# EAGLE schematic gator (EAGLE 6.3)
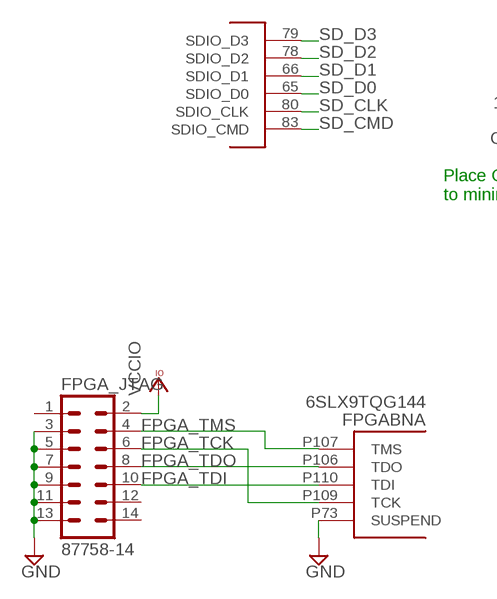
[diagram p0: schematic, sheet 1, part 1 of 2]
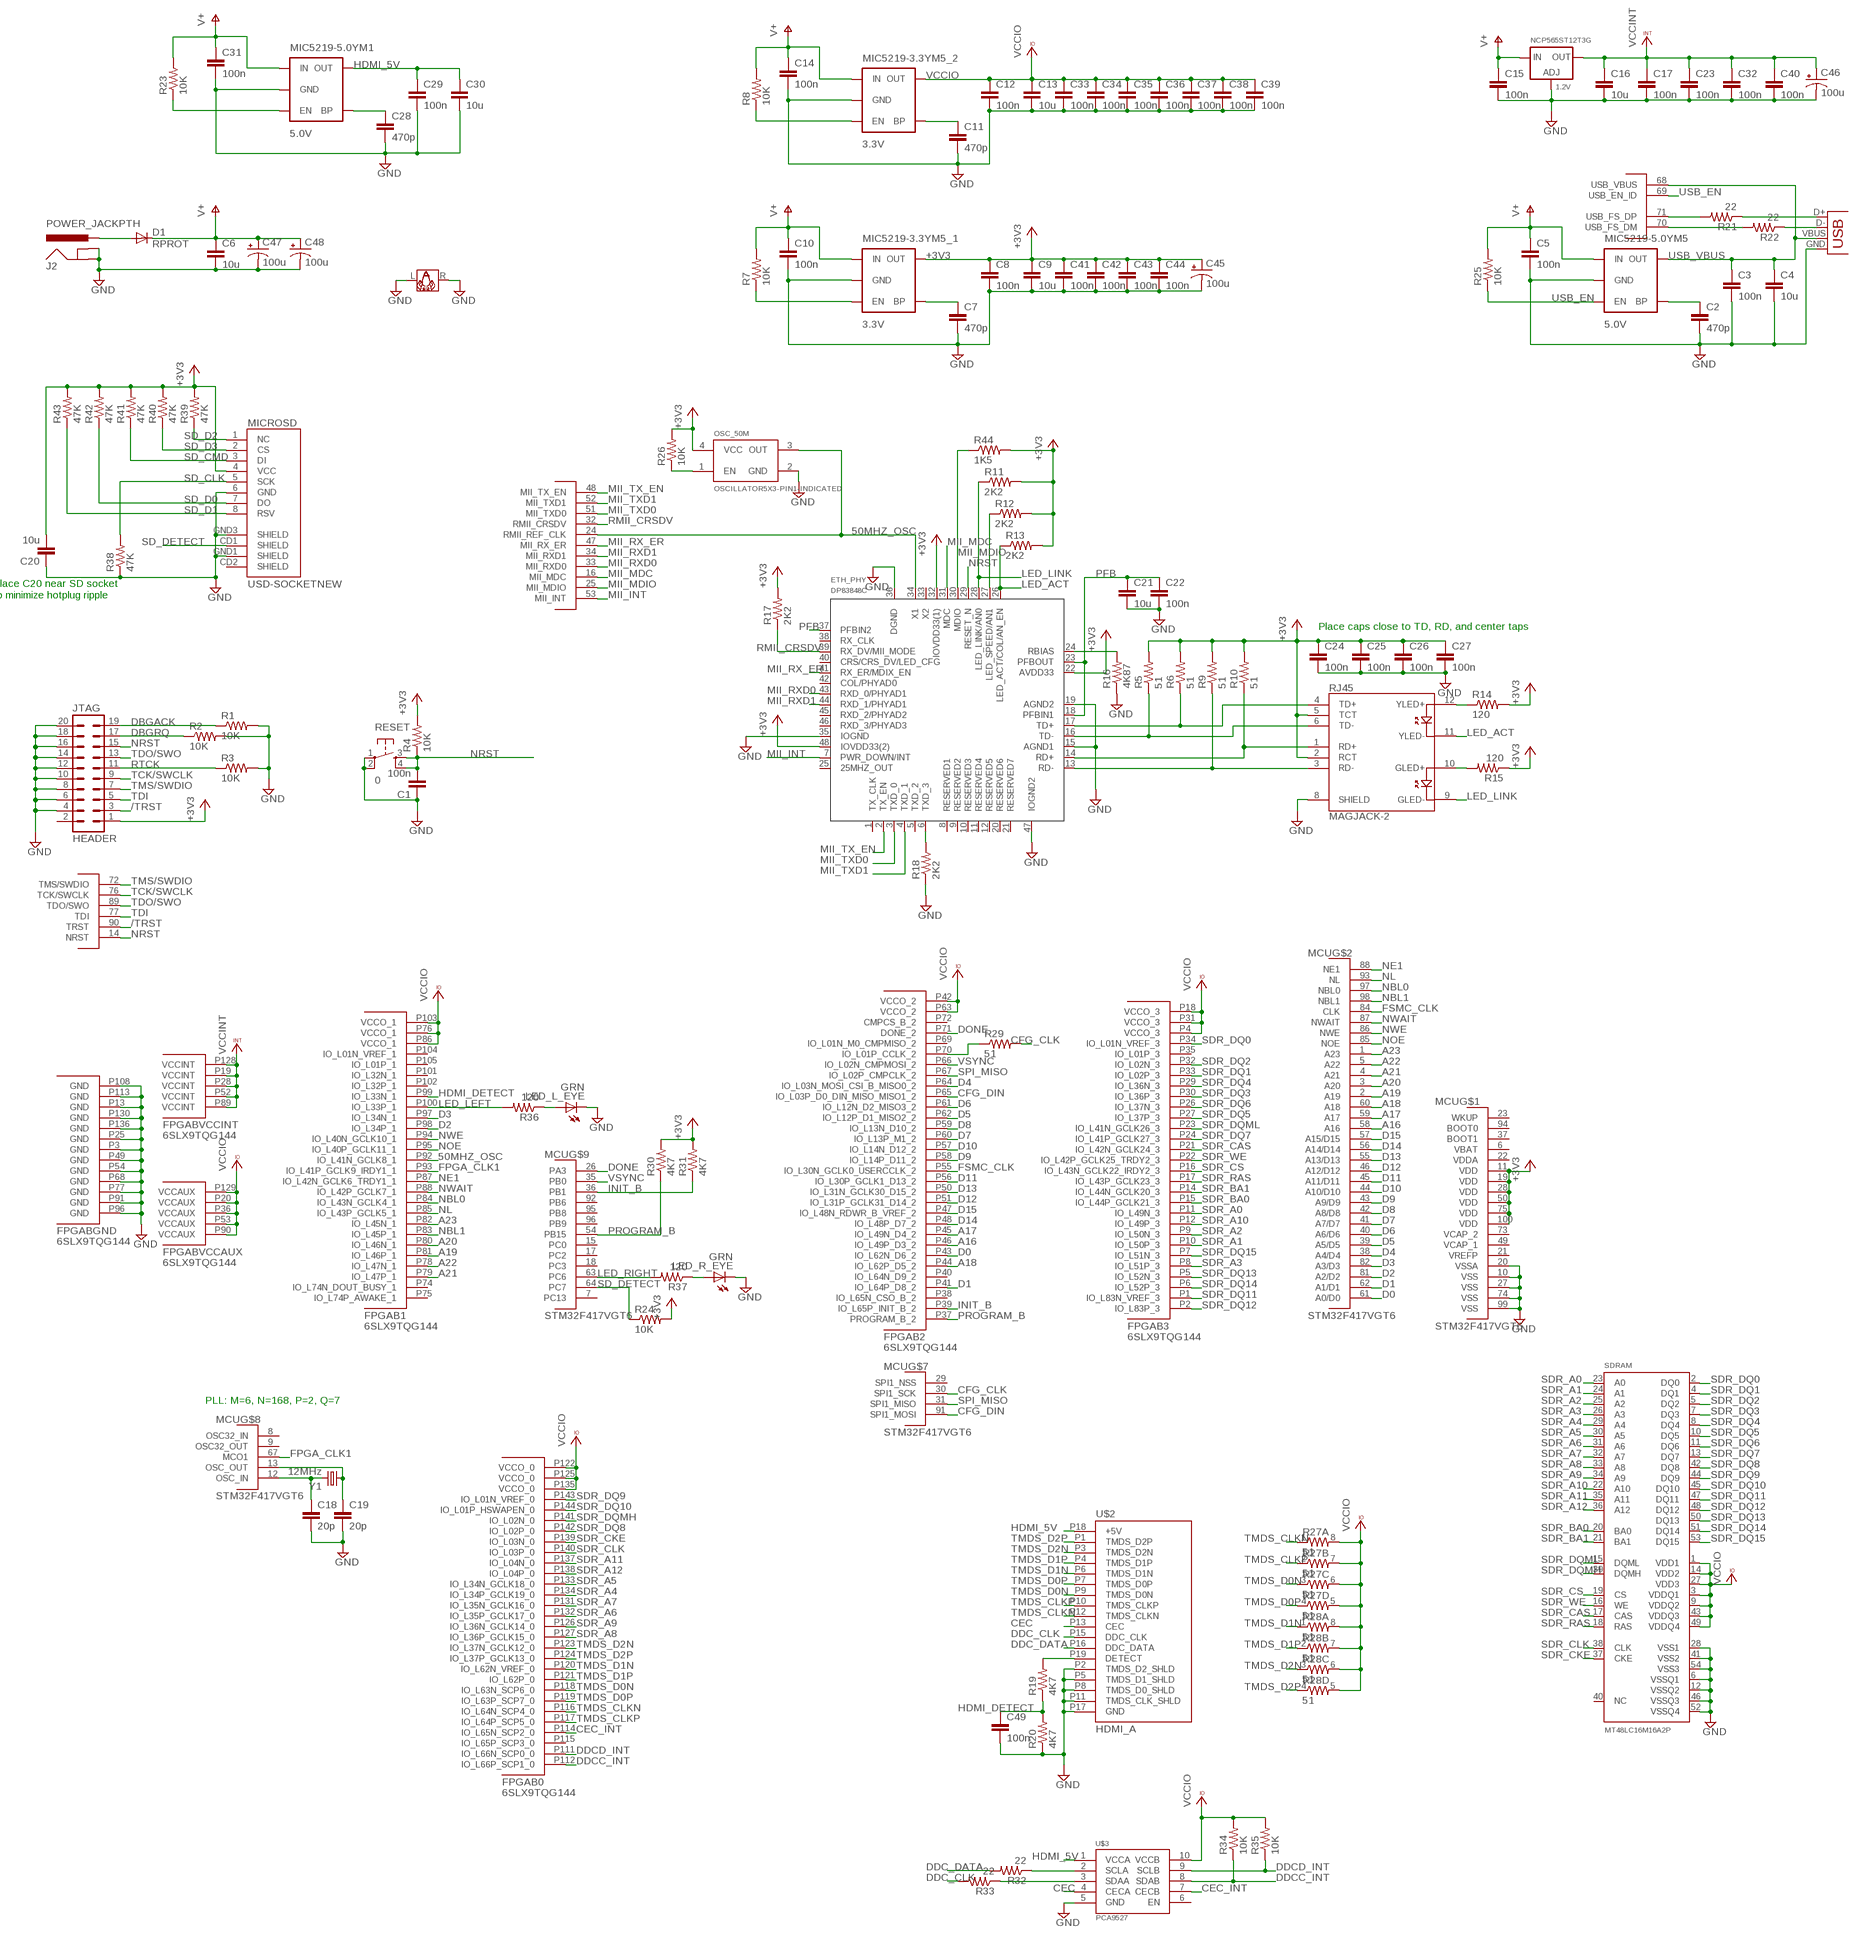
[diagram p1: schematic, sheet 1, part 2 of 2]

## Parts
C1  100n  CAP0603-CAP  [0603-CAP]
C2  470p  CAP0603-CAP  [0603-CAP]
C3  100n  CAP0603-CAP  [0603-CAP]
C4  10u  CAP0603-CAP  [0603-CAP]
C5  100n  CAP0603-CAP  [0603-CAP]
C6  10u  CAP0603-CAP  [0603-CAP]
C7  470p  CAP0603-CAP  [0603-CAP]
C8  100n  CAP0603-CAP  [0603-CAP]
C9  10u  CAP0603-CAP  [0603-CAP]
C10  100n  CAP0603-CAP  [0603-CAP]
C11  470p  CAP0603-CAP  [0603-CAP]
C12  100n  CAP0603-CAP  [0603-CAP]
C13  10u  CAP0603-CAP  [0603-CAP]
C14  100n  CAP0603-CAP  [0603-CAP]
C15  100n  CAP0603-CAP  [0603-CAP]
C16  10u  CAP0603-CAP  [0603-CAP]
C17  100n  CAP0603-CAP  [0603-CAP]
C18  20p  CAP0603-CAP  [0603-CAP]
C19  20p  CAP0603-CAP  [0603-CAP]
C20  10u  CAP0603-CAP  [0603-CAP]
C21  10u  CAP0603-CAP  [0603-CAP]
C22  100n  CAP0603-CAP  [0603-CAP]
C23  100n  CAP0603-CAP  [0603-CAP]
C24  100n  CAP0603-CAP  [0603-CAP]
C25  100n  CAP0603-CAP  [0603-CAP]
C26  100n  CAP0603-CAP  [0603-CAP]
C27  100n  CAP0603-CAP  [0603-CAP]
C28  470p  CAP0603-CAP  [0603-CAP]
C29  100n  CAP0603-CAP  [0603-CAP]
C30  10u  CAP0603-CAP  [0603-CAP]
C31  100n  CAP0603-CAP  [0603-CAP]
C32  100n  CAP0603-CAP  [0603-CAP]
C33  100n  CAP0603-CAP  [0603-CAP]
C34  100n  CAP0603-CAP  [0603-CAP]
C35  100n  CAP0603-CAP  [0603-CAP]
C36  100n  CAP0603-CAP  [0603-CAP]
C37  100n  CAP0603-CAP  [0603-CAP]
C38  100n  CAP0603-CAP  [0603-CAP]
C39  100n  CAP0603-CAP  [0603-CAP]
C40  100n  CAP0603-CAP  [0603-CAP]
C41  100n  CAP0603-CAP  [0603-CAP]
C42  100n  CAP0603-CAP  [0603-CAP]
C43  100n  CAP0603-CAP  [0603-CAP]
C44  100n  CAP0603-CAP  [0603-CAP]
C45  100u  CAP_POLPTH1  [CPOL-RADIAL-100UF-25V]
C46  100u  CAP_POLPTH1  [CPOL-RADIAL-100UF-25V]
C47  100u  CAP_POLPTH1  [CPOL-RADIAL-100UF-25V]
C48  100u  CAP_POLPTH1  [CPOL-RADIAL-100UF-25V]
C49  100n  CAP0603-CAP  [0603-CAP]
D1  RPROT  DIODEPTH  [DIODE-1N4001]
ETH_PHY  DP83848C  [LQFP-48]
FPGA  6SLX9TQG144  [TQ144]
FPGA_JTAG  87758-14  [87758-14]
J2  POWER_JACKPTH  [POWER_JACK_PTH]
JTAG  HEADER  ML20  [ML20]
LED_L_EYE  GRN  LED3MM  [LED3MM]
LED_R_EYE  GRN  LED3MM  [LED3MM]
MCU  STM32F417VGT6  [LQFP-100]
MIC5219-3.3YM5_1  3.3V  V_REG_LDOSMD  [SOT23-5]
MIC5219-3.3YM5_2  3.3V  V_REG_LDOSMD  [SOT23-5]
MIC5219-5.0YM1  5.0V  V_REG_LDOSMD  [SOT23-5]
MIC5219-5.0YM5  5.0V  V_REG_LDOSMD  [SOT23-5]
MICROSD  USD-SOCKETNEW  [MICRO-SD-SOCKET-PP]
NCP565ST12T3G  1.2V  LM1117SOT223-REFLOW  [SOT223-R]
OSC_50M  OSCILLATOR5X3-PIN1-INDICATED  [CRYSTAL-OSC-SMD-5X3]
R1  10K  RESISTOR0603-RES  [0603-RES]
R2  10K  RESISTOR0603-RES  [0603-RES]
R3  10K  RESISTOR0603-RES  [0603-RES]
R4  10K  RESISTOR0603-RES  [0603-RES]
R5  51  RESISTOR0603-RES  [0603-RES]
R6  51  RESISTOR0603-RES  [0603-RES]
R7  10K  RESISTOR0603-RES  [0603-RES]
R8  10K  RESISTOR0603-RES  [0603-RES]
R9  51  RESISTOR0603-RES  [0603-RES]
R10  51  RESISTOR0603-RES  [0603-RES]
R11  2K2  RESISTOR0603-RES  [0603-RES]
R12  2K2  RESISTOR0603-RES  [0603-RES]
R13  2K2  RESISTOR0603-RES  [0603-RES]
R14  120  RESISTOR0603-RES  [0603-RES]
R15  120  RESISTOR0603-RES  [0603-RES]
R16  4K87  RESISTOR0603-RES  [0603-RES]
R17  2K2  RESISTOR0603-RES  [0603-RES]
R18  2K2  RESISTOR0603-RES  [0603-RES]
R19  4K7  RESISTOR0603-RES  [0603-RES]
R20  4K7  RESISTOR0603-RES  [0603-RES]
R21  22  RESISTOR0603-RES  [0603-RES]
R22  22  RESISTOR0603-RES  [0603-RES]
R23  10K  RESISTOR0603-RES  [0603-RES]
R24  10K  RESISTOR0603-RES  [0603-RES]
R25  10K  RESISTOR0603-RES  [0603-RES]
R26  10K  RESISTOR0603-RES  [0603-RES]
R27  51  RESISTOR-ARRAY0603-ARV  [0603-ARV]
R28  51  RESISTOR-ARRAY0603-ARV  [0603-ARV]
R29  51  RESISTOR0603-RES  [0603-RES]
R30  4K7  RESISTOR0603-RES  [0603-RES]
R31  4K7  RESISTOR0603-RES  [0603-RES]
R32  22  RESISTOR0603-RES  [0603-RES]
R33  22  RESISTOR0603-RES  [0603-RES]
R34  10K  RESISTOR0603-RES  [0603-RES]
R35  10K  RESISTOR0603-RES  [0603-RES]
R36  120  RESISTOR0603-RES  [0603-RES]
R37  120  RESISTOR0603-RES  [0603-RES]
R38  47K  RESISTOR0603-RES  [0603-RES]
R39  47K  RESISTOR0603-RES  [0603-RES]
R40  47K  RESISTOR0603-RES  [0603-RES]
R41  47K  RESISTOR0603-RES  [0603-RES]
R42  47K  RESISTOR0603-RES  [0603-RES]
R43  47K  RESISTOR0603-RES  [0603-RES]
R44  1K5  RESISTOR0603-RES  [0603-RES]
RESET  0  TAC_SWITCHPTH  [TACTILE-PTH]
RJ45  MAGJACK-2  [MAGJACK-19938]
SDRAM  MT48LC16M16A2P  [TSOP54-400]
U$2  HDMI_A  [HDMI_A_SMT]
U$3  PCA9527  [TSSOP10]
U$4  GATOR_HEAD  [GATOR_HEAD]
X1  USB-A-S  [USB-A-S]
Y1  12MHz  CRYSTALHC49US  [HC49US]

## Nets
50MHZ_OSC: ETH_PHY.34(X1) FPGA.P92(B1:IO_L41N_GCLK8_1) MCU.24(RMII_REF_CLK) OSC_50M.3(OUT)
+3V3: C8.1 C9.1 C20.2 C24.1 C25.1 C26.1 C27.1 C41.1 C42.1 C43.1 C44.1 C45.1(+) ETH_PHY.22(AVDD33) ETH_PHY.32(IOVDD33(1)) ETH_PHY.48(IOVDD33(2)) JTAG.1 MCU.11(VDD) MCU.19(VDD) MCU.28(VDD) MCU.50(VDD) MCU.75(VDD) MCU.100(VDD) MIC5219-3.3YM5_1.5(OUT) MICROSD.4(VCC) OSC_50M.4(VCC) R4.2 R5.2 R6.2 R9.2 R10.2 R11.2 R12.2 R13.2 R14.2 R15.1 R17.2 R24.2 R26.2 R30.2 R31.2 R39.2 R40.2 R41.2 R42.2 R43.2 R44.2 RJ45.2(RCT) RJ45.5(TCT)
/TRST: JTAG.3 MCU.90(TRST)
A16: FPGA.P46(B2:IO_L49P_D3_2) MCU.58(A16)
A17: FPGA.P45(B2:IO_L49N_D4_2) MCU.59(A17)
A18: FPGA.P44(B2:IO_L62P_D5_2) MCU.60(A18)
A19: FPGA.P81(B1:IO_L46P_1) MCU.2(A19)
A20: FPGA.P80(B1:IO_L46N_1) MCU.3(A20)
A21: FPGA.P79(B1:IO_L47P_1) MCU.4(A21)
A22: FPGA.P78(B1:IO_L47N_1) MCU.5(A22)
A23: FPGA.P82(B1:IO_L45N_1) MCU.1(A23)
CEC: U$2.P13(CEC) U$3.4(CECA)
CEC_INT: FPGA.P114(B0:IO_L65N_SCP2_0) U$3.7(CECB)
CFG_CLK: MCU.30(SPI1_SCK) R29.2
CFG_DIN: FPGA.P65(B2:IO_L03P_D0_DIN_MISO_MISO1_2) MCU.91(SPI1_MOSI)
D0: FPGA.P43(B2:IO_L62N_D6_2) MCU.61(A0/D0)
D1: FPGA.P41(B2:IO_L64P_D8_2) MCU.62(A1/D1)
D2: FPGA.P98(B1:IO_L34P_1) MCU.81(A2/D2)
D3: FPGA.P97(B1:IO_L34N_1) MCU.82(A3/D3)
D4: FPGA.P64(B2:IO_L03N_MOSI_CSI_B_MISO0_2) MCU.38(A4/D4)
D5: FPGA.P62(B2:IO_L12P_D1_MISO2_2) MCU.39(A5/D5)
D6: FPGA.P61(B2:IO_L12N_D2_MISO3_2) MCU.40(A6/D6)
D7: FPGA.P60(B2:IO_L13P_M1_2) MCU.41(A7/D7)
D8: FPGA.P59(B2:IO_L13N_D10_2) MCU.42(A8/D8)
D9: FPGA.P58(B2:IO_L14P_D11_2) MCU.43(A9/D9)
D10: FPGA.P57(B2:IO_L14N_D12_2) MCU.44(A10/D10)
D11: FPGA.P56(B2:IO_L30P_GCLK1_D13_2) MCU.45(A11/D11)
D12: FPGA.P51(B2:IO_L31P_GCLK31_D14_2) MCU.46(A12/D12)
D13: FPGA.P50(B2:IO_L31N_GCLK30_D15_2) MCU.55(A13/D13)
D14: FPGA.P48(B2:IO_L48P_D7_2) MCU.56(A14/D14)
D15: FPGA.P47(B2:IO_L48N_RDWR_B_VREF_2) MCU.57(A15/D15)
DBGACK: JTAG.19 R1.1
DBGRQ: JTAG.17 R2.1
DDC_CLK: R33.2 U$2.P15(DDC_CLK)
DDC_DATA: R32.2 U$2.P16(DDC_DATA)
DDCC_INT: FPGA.P112(B0:IO_L66P_SCP1_0) R34.1 U$3.8(SDAB)
DDCD_INT: FPGA.P111(B0:IO_L66N_SCP0_0) R35.1 U$3.9(SCLB)
DONE: FPGA.P71(B2:DONE_2) MCU.26(PA3)
FPGA_CLK1: FPGA.P93(B1:IO_L41P_GCLK9_IRDY1_1) MCU.67(MCO1)
FPGA_TCK: FPGA.P109(BNA:TCK) FPGA_JTAG.6
FPGA_TDI: FPGA.P110(BNA:TDI) FPGA_JTAG.10
FPGA_TDO: FPGA.P106(BNA:TDO) FPGA_JTAG.8
FPGA_TMS: FPGA.P107(BNA:TMS) FPGA_JTAG.4
FSMC_CLK: FPGA.P55(B2:IO_L30N_GCLK0_USERCCLK_2) MCU.84(CLK)
GND: C1.1 C2.2 C3.2 C4.2 C5.2 C6.2 C7.2 C8.2 C9.2 C10.2 C11.2 C12.2 C13.2 C14.2 C15.2 C16.2 C17.2 C18.2 C19.2 C20.1 C21.2 C22.2 C23.2 C24.2 C25.2 C26.2 C27.2 C28.2 C29.2 C30.2 C31.2 C32.2 C33.2 C34.2 C35.2 C36.2 C37.2 C38.2 C39.2 C40.2 C41.2 C42.2 C43.2 C44.2 C45.2(-) C46.2(-) C47.2(-) C48.2(-) C49.2 ETH_PHY.15(AGND1) ETH_PHY.19(AGND2) ETH_PHY.35(IOGND) ETH_PHY.36(DGND) ETH_PHY.47(IOGND2) FPGA.P3(BGND:GND) FPGA.P13(BGND:GND) FPGA.P25(BGND:GND) FPGA.P49(BGND:GND) FPGA.P54(BGND:GND) FPGA.P68(BGND:GND) FPGA.P73(BNA:SUSPEND) FPGA.P77(BGND:GND) FPGA.P91(BGND:GND) FPGA.P96(BGND:GND) FPGA.P108(BGND:GND) FPGA.P113(BGND:GND) FPGA.P130(BGND:GND) FPGA.P136(BGND:GND) FPGA_JTAG.3 FPGA_JTAG.5 FPGA_JTAG.7 FPGA_JTAG.9 FPGA_JTAG.11 FPGA_JTAG.13 J2.GND J2.GNDBREAK JTAG.4 JTAG.6 JTAG.8 JTAG.10 JTAG.12 JTAG.14 JTAG.16 JTAG.18 JTAG.20 LED_L_EYE.K(C) LED_R_EYE.K(C) MCU.10(VSS) MCU.20(VSSA) MCU.27(VSS) MCU.74(VSS) MCU.99(VSS) MIC5219-3.3YM5_1.2(GND) MIC5219-3.3YM5_2.2(GND) MIC5219-5.0YM1.2(GND) MIC5219-5.0YM5.2(GND) MICROSD.6(GND) MICROSD.GND1(SHIELD) MICROSD.GND3(SHIELD) NCP565ST12T3G.1(ADJ) OSC_50M.2(GND) R1.2 R2.2 R3.2 R16.1 R18.1 R20.1 R38.1 RESET.1 RESET.2 RJ45.8(SHIELD) SDRAM.6(VSSQ1) SDRAM.12(VSSQ2) SDRAM.28(VSS1) SDRAM.41(VSS2) SDRAM.46(VSSQ3) SDRAM.52(VSSQ4) SDRAM.54(VSS3) U$2.P2(TMDS_D2_SHLD) U$2.P5(TMDS_D1_SHLD) U$2.P8(TMDS_D0_SHLD) U$2.P11(TMDS_CLK_SHLD) U$2.P17(GND) U$3.5(GND) U$4.L U$4.R X1.GND
HDMI_5V: C29.1 C30.1 MIC5219-5.0YM1.5(OUT) U$2.P18(+5V) U$3.1(VCCA)
HDMI_DETECT: C49.1 FPGA.P99(B1:IO_L33N_1) R19.1 R20.2
INIT_B: FPGA.P39(B2:IO_L65P_INIT_B_2) MCU.36(PB1) R31.1
LED_ACT: ETH_PHY.26(LED_ACT/COL/AN_EN) R13.1 RJ45.11(YLED-)
LED_LEFT: FPGA.P100(B1:IO_L33P_1) R36.2
LED_LINK: ETH_PHY.28(LED_LINK/AN0) R11.1 RJ45.9(GLED-)
LED_RIGHT: MCU.63(PC6) R37.2
MII_INT: ETH_PHY.7(PWR_DOWN/INT) MCU.53(MII_INT)
MII_MDC: ETH_PHY.31(MDC) MCU.16(MII_MDC)
MII_MDIO: ETH_PHY.30(MDIO) MCU.25(MII_MDIO) R44.1
MII_RX_ER: ETH_PHY.41(RX_ER/MDIX_EN) MCU.47(MII_RX_ER)
MII_RXD0: ETH_PHY.43(RXD_0/PHYAD1) MCU.33(MII_RXD0)
MII_RXD1: ETH_PHY.44(RXD_1/PHYAD1) MCU.34(MII_RXD1)
MII_TX_EN: ETH_PHY.2(TX_EN) MCU.48(MII_TX_EN)
MII_TXD0: ETH_PHY.3(TXD_0) MCU.51(MII_TXD0)
MII_TXD1: ETH_PHY.4(TXD_1) MCU.52(MII_TXD1)
N$1: MCU.71(USB_FS_DP) R21.2
N$2: MCU.70(USB_FS_DM) R22.2
N$3: D1.A J2.PWR
N$4: C2.1 MIC5219-5.0YM5.4(BP)
N$5: MIC5219-3.3YM5_1.3(EN) R7.1
N$7: C7.1 MIC5219-3.3YM5_1.4(BP)
N$8: MIC5219-3.3YM5_2.3(EN) R8.1
N$9: R32.1 U$3.2(SCLA)
N$10: R33.1 U$3.3(SDAA)
N$11: LED_L_EYE.A R36.1
N$12: LED_R_EYE.A R37.1
N$13: R14.1 RJ45.12(YLED+)
N$14: R15.2 RJ45.10(GLED+)
N$15: C28.1 MIC5219-5.0YM1.4(BP)
N$16: ETH_PHY.24(RBIAS) R16.2
N$17: ETH_PHY.27(LED_SPEED/AN1) R12.1
N$18: ETH_PHY.6(TXD_3) R18.2
N$19: R21.1 X1.D+
N$20: R22.1 X1.D-
N$21: MIC5219-5.0YM1.3(EN) R23.1
N$22: R19.2 U$2.P19(DETECT)
N$29: C18.1 MCU.12(OSC_IN) Y1.2
N$30: C19.1 MCU.13(OSC_OUT) Y1.1
N$31: OSC_50M.1(EN) R26.1
N$33: FPGA.P70(B2:IO_L01P_CCLK_2) R29.1
N$34: C11.1 MIC5219-3.3YM5_2.4(BP)
NBL0: FPGA.P84(B1:IO_L43N_GCLK4_1) MCU.97(NBL0)
NBL1: FPGA.P83(B1:IO_L45P_1) MCU.98(NBL1)
NE1: FPGA.P87(B1:IO_L42N_GCLK6_TRDY1_1) MCU.88(NE1)
NL: FPGA.P85(B1:IO_L43P_GCLK5_1) MCU.93(NL)
NOE: FPGA.P95(B1:IO_L40P_GCLK11_1) MCU.85(NOE)
NRST: C1.2 ETH_PHY.29(RESET_N) JTAG.15 MCU.14(NRST) R4.1 RESET.3 RESET.4
NWAIT: FPGA.P88(B1:IO_L42P_GCLK7_1) MCU.87(NWAIT)
NWE: FPGA.P94(B1:IO_L40N_GCLK10_1) MCU.86(NWE)
PFB: C21.1 C22.1 ETH_PHY.18(PFBIN1) ETH_PHY.23(PFBOUT) ETH_PHY.37(PFBIN2)
PROGRAM_B: FPGA.P37(B2:PROGRAM_B_2) MCU.54(PB15) R30.1
RD+: ETH_PHY.14(RD+) R10.1 RJ45.1(RD+)
RD-: ETH_PHY.13(RD-) R9.1 RJ45.3(RD-)
RMII_CRSDV: ETH_PHY.39(RX_DV/MII_MODE) MCU.32(RMII_CRSDV) R17.1
RTCK: JTAG.11 R3.1
SD_CLK: MCU.80(SDIO_CLK) MICROSD.5(SCK) R38.2
SD_CMD: MCU.83(SDIO_CMD) MICROSD.3(DI) R41.1
SD_D0: MCU.65(SDIO_D0) MICROSD.7(DO) R42.1
SD_D1: MCU.66(SDIO_D1) MICROSD.8(RSV) R43.1
SD_D2: MCU.78(SDIO_D2) MICROSD.1(NC) R39.1
SD_D3: MCU.79(SDIO_D3) MICROSD.2(CS) R40.1
SD_DETECT: MCU.64(PC7) MICROSD.CD1(SHIELD) R24.1
SDR_A0: FPGA.P11(B3:IO_L49N_3) SDRAM.23(A0)
SDR_A1: FPGA.P10(B3:IO_L50P_3) SDRAM.24(A1)
SDR_A2: FPGA.P9(B3:IO_L50N_3) SDRAM.25(A2)
SDR_A3: FPGA.P8(B3:IO_L51P_3) SDRAM.26(A3)
SDR_A4: FPGA.P134(B0:IO_L34P_GCLK19_0) SDRAM.29(A4)
SDR_A5: FPGA.P133(B0:IO_L34N_GCLK18_0) SDRAM.30(A5)
SDR_A6: FPGA.P132(B0:IO_L35P_GCLK17_0) SDRAM.31(A6)
SDR_A7: FPGA.P131(B0:IO_L35N_GCLK16_0) SDRAM.32(A7)
SDR_A8: FPGA.P127(B0:IO_L36P_GCLK15_0) SDRAM.33(A8)
SDR_A9: FPGA.P126(B0:IO_L36N_GCLK14_0) SDRAM.34(A9)
SDR_A10: FPGA.P12(B3:IO_L49P_3) SDRAM.22(A10)
SDR_A11: FPGA.P137(B0:IO_L04N_0) SDRAM.35(A11)
SDR_A12: FPGA.P138(B0:IO_L04P_0) SDRAM.36(A12)
SDR_BA0: FPGA.P15(B3:IO_L44P_GCLK21_3) SDRAM.20(BA0)
SDR_BA1: FPGA.P14(B3:IO_L44N_GCLK20_3) SDRAM.21(BA1)
SDR_CAS: FPGA.P21(B3:IO_L42N_GCLK24_3) SDRAM.17(CAS)
SDR_CKE: FPGA.P139(B0:IO_L03N_0) SDRAM.37(CKE)
SDR_CLK: FPGA.P140(B0:IO_L03P_0) SDRAM.38(CLK)
SDR_CS: FPGA.P16(B3:IO_L43N_GCLK22_IRDY2_3) SDRAM.19(CS)
SDR_DQ0: FPGA.P34(B3:IO_L01N_VREF_3) SDRAM.2(DQ0)
SDR_DQ1: FPGA.P33(B3:IO_L02P_3) SDRAM.4(DQ1)
SDR_DQ2: FPGA.P32(B3:IO_L02N_3) SDRAM.5(DQ2)
SDR_DQ3: FPGA.P30(B3:IO_L36P_3) SDRAM.7(DQ3)
SDR_DQ4: FPGA.P29(B3:IO_L36N_3) SDRAM.8(DQ4)
SDR_DQ5: FPGA.P27(B3:IO_L37P_3) SDRAM.10(DQ5)
SDR_DQ6: FPGA.P26(B3:IO_L37N_3) SDRAM.11(DQ6)
SDR_DQ7: FPGA.P24(B3:IO_L41P_GCLK27_3) SDRAM.13(DQ7)
SDR_DQ8: FPGA.P142(B0:IO_L02P_0) SDRAM.42(DQ8)
SDR_DQ9: FPGA.P143(B0:IO_L01N_VREF_0) SDRAM.44(DQ9)
SDR_DQ10: FPGA.P144(B0:IO_L01P_HSWAPEN_0) SDRAM.45(DQ10)
SDR_DQ11: FPGA.P1(B3:IO_L83N_VREF_3) SDRAM.47(DQ11)
SDR_DQ12: FPGA.P2(B3:IO_L83P_3) SDRAM.48(DQ12)
SDR_DQ13: FPGA.P5(B3:IO_L52N_3) SDRAM.50(DQ13)
SDR_DQ14: FPGA.P6(B3:IO_L52P_3) SDRAM.51(DQ14)
SDR_DQ15: FPGA.P7(B3:IO_L51N_3) SDRAM.53(DQ15)
SDR_DQMH: FPGA.P141(B0:IO_L02N_0) SDRAM.39(DQMH)
SDR_DQML: FPGA.P23(B3:IO_L41N_GCLK26_3) SDRAM.15(DQML)
SDR_RAS: FPGA.P17(B3:IO_L43P_GCLK23_3) SDRAM.18(RAS)
SDR_WE: FPGA.P22(B3:IO_L42P_GCLK25_TRDY2_3) SDRAM.16(WE)
SPI_MISO: FPGA.P67(B2:IO_L02P_CMPCLK_2) MCU.31(SPI1_MISO)
TCK/SWCLK: JTAG.9 MCU.76(TCK/SWCLK)
TD+: ETH_PHY.17(TD+) R6.1 RJ45.4(TD+)
TD-: ETH_PHY.16(TD-) R5.1 RJ45.6(TD-)
TDI: JTAG.5 MCU.77(TDI)
TDO/SWO: JTAG.13 MCU.89(TDO/SWO)
TMDS_CLKN: FPGA.P116(B0:IO_L64N_SCP4_0) R27.1 U$2.P12(TMDS_CLKN)
TMDS_CLKP: FPGA.P117(B0:IO_L64P_SCP5_0) R27.2 U$2.P10(TMDS_CLKP)
TMDS_D0N: FPGA.P118(B0:IO_L63N_SCP6_0) R27.3 U$2.P9(TMDS_D0N)
TMDS_D0P: FPGA.P119(B0:IO_L63P_SCP7_0) R27.4 U$2.P7(TMDS_D0P)
TMDS_D1N: FPGA.P120(B0:IO_L62N_VREF_0) R28.1 U$2.P6(TMDS_D1N)
TMDS_D1P: FPGA.P121(B0:IO_L62P_0) R28.2 U$2.P4(TMDS_D1P)
TMDS_D2N: FPGA.P123(B0:IO_L37N_GCLK12_0) R28.3 U$2.P3(TMDS_D2N)
TMDS_D2P: FPGA.P124(B0:IO_L37P_GCLK13_0) R28.4 U$2.P1(TMDS_D2P)
TMS/SWDIO: JTAG.7 MCU.72(TMS/SWDIO)
USB_EN: MCU.69(USB_EN_ID) MIC5219-5.0YM5.3(EN) R25.1
USB_VBUS: C3.1 C4.1 MCU.68(USB_VBUS) MIC5219-5.0YM5.5(OUT) X1.VBUS
V+: C5.1 C6.1 C10.1 C14.1 C15.1 C31.1 C47.1(+) C48.1(+) D1.C MIC5219-3.3YM5_1.1(IN) MIC5219-3.3YM5_2.1(IN) MIC5219-5.0YM1.1(IN) MIC5219-5.0YM5.1(IN) NCP565ST12T3G.3(IN) R7.2 R8.2 R23.2 R25.2
VCCINT: C16.1 C17.1 C23.1 C32.1 C40.1 C46.1(+) FPGA.P19(BVCCINT:VCCINT) FPGA.P28(BVCCINT:VCCINT) FPGA.P52(BVCCINT:VCCINT) FPGA.P89(BVCCINT:VCCINT) FPGA.P128(BVCCINT:VCCINT) NCP565ST12T3G.2(OUT)
VCCIO: C12.1 C13.1 C33.1 C34.1 C35.1 C36.1 C37.1 C38.1 C39.1 FPGA.P4(B3:VCCO_3) FPGA.P18(B3:VCCO_3) FPGA.P20(BVCCAUX:VCCAUX) FPGA.P31(B3:VCCO_3) FPGA.P36(BVCCAUX:VCCAUX) FPGA.P42(B2:VCCO_2) FPGA.P53(BVCCAUX:VCCAUX) FPGA.P63(B2:VCCO_2) FPGA.P76(B1:VCCO_1) FPGA.P86(B1:VCCO_1) FPGA.P90(BVCCAUX:VCCAUX) FPGA.P103(B1:VCCO_1) FPGA.P122(B0:VCCO_0) FPGA.P125(B0:VCCO_0) FPGA.P129(BVCCAUX:VCCAUX) FPGA.P135(B0:VCCO_0) FPGA_JTAG.2 MIC5219-3.3YM5_2.5(OUT) R27.5 R27.6 R27.7 R27.8 R28.5 R28.6 R28.7 R28.8 R34.2 R35.2 SDRAM.1(VDD1) SDRAM.3(VDDQ1) SDRAM.9(VDDQ2) SDRAM.14(VDD2) SDRAM.27(VDD3) SDRAM.43(VDDQ3) SDRAM.49(VDDQ4) U$3.10(VCCB)
VSYNC: FPGA.P66(B2:IO_L02N_CMPMOSI_2) MCU.35(PB0)
Unconnected: ETH_PHY.1(TX_CLK) ETH_PHY.5(TXD_2) ETH_PHY.8(RESERVED1) ETH_PHY.9(RESERVED2) ETH_PHY.10(RESERVED3) ETH_PHY.11(RESERVED4) ETH_PHY.12(RESERVED5) ETH_PHY.20(RESERVED6) ETH_PHY.21(RESERVED7) ETH_PHY.25(25MHZ_OUT) ETH_PHY.33(X2) ETH_PHY.38(RX_CLK) ETH_PHY.40(CRS/CRS_DV/LED_CFG) ETH_PHY.42(COL/PHYAD0) ETH_PHY.45(RXD_2/PHYAD2) ETH_PHY.46(RXD_3/PHYAD3) FPGA.P35(B3:IO_L01P_3) FPGA.P38(B2:IO_L65N_CSO_B_2) FPGA.P40(B2:IO_L64N_D9_2) FPGA.P69(B2:IO_L01N_M0_CMPMISO_2) FPGA.P72(B2:CMPCS_B_2) FPGA.P74(B1:IO_L74N_DOUT_BUSY_1) FPGA.P75(B1:IO_L74P_AWAKE_1) FPGA.P101(B1:IO_L32N_1) FPGA.P102(B1:IO_L32P_1) FPGA.P104(B1:IO_L01N_VREF_1) FPGA.P105(B1:IO_L01P_1) FPGA.P115(B0:IO_L65P_SCP3_0) FPGA_JTAG.1 FPGA_JTAG.12 FPGA_JTAG.14 JTAG.2 MCU.6(VBAT) MCU.7(PC13) MCU.8(OSC32_IN) MCU.9(OSC32_OUT) MCU.15(PC0) MCU.17(PC2) MCU.18(PC3) MCU.21(VREFP) MCU.22(VDDA) MCU.23(WKUP) MCU.29(SPI1_NSS) MCU.37(BOOT1) MCU.49(VCAP_1) MCU.73(VCAP_2) MCU.92(PB6) MCU.94(BOOT0) MCU.95(PB8) MCU.96(PB9) MICROSD.CD2(SHIELD) SDRAM.40(NC) U$3.6(EN)

## Notes on the sheet
- Place C20 near SD socket
  to minimize hotplug ripple
- Place caps close to TD, RD, and center taps
- PLL: M=6, N=168, P=2, Q=7

## Library data of the parts
C1-C44 C49 = SparkFun-Passives:CAP: Capacitor Standard 0603 ceramic capacitor, and 0.1" leaded capacitor.
C45-C48 = SparkFun-Passives:CAP_POL: Capacitor Polarized These are standard SMD and PTH capacitors. Normally 10uF, 47uF, and 100uF in electrolytic and tantalum varieties. Always verify the external diameter of the through hole cap, it varies with capacity, voltage, and manufacturer. The EIA devices should be standard.
D1 = SparkFun-DiscreteSemi:DIODE: Diode These are standard reverse protection diodes and small signal diodes. SMA package can handle up to about 1A. SOD-323 can handle about 200mA. What the SOD-323 package when ordering, there are some mfgs out there that are 5-pin packages.; DIGIKEY#: 497-6588-1-ND; MANF: STMicroelectronics; MANF#: STPS5L40RL
ETH_PHY = gator:DP83848C; DIGIKEY#: DP83848CVVX/NOPBCT-ND; MANF: Texas Instruments; MANF#: DP83848CVVX/NOPB; MOUSER#: 926-DP83848CVVX/NOPB
FPGA = xilinx_devices:6SLX9TQG144: Xilinx FPGA: 6SLX9TQG144; DIGIKEY#: 122-1745-ND; MANF: Xilinx Inc; MANF#: XC6SLX9-2TQG144C
FPGA_JTAG = con-molex-milli-grid:87758-14: HEADER; DIGIKEY#: AE10561-ND; MANF: Assmann WSW Components; MANF#: AWHW2-14G-0202-T-R
J2 = SparkFun-Connectors:POWER_JACK: Power Jack This is the standard 5.5mm barrel jack for power. The PTH is the most common, proven, reliable, footprint. All others are experimental. The Slot footprint only works if the mill layer is transmitted to the PCB fab house so be warned. Spark Fun Electronics SKU : PRT-00119. Mating wall wart : TOL-00298 (and others); DIGIKEY#: CP-002A-ND; MANF: CUI Inc; MANF#: PJ-002A
JTAG = con-ml:ML20: HARTING; DIGIKEY#: S9172-ND; MANF: Sullins Connector Solutions; MANF#: SBH11-PBPC-D10-ST-BK; OC_FARNELL: unknown; OC_NEWARK: unknown
LED_L_EYE LED_R_EYE = led:LED: LED OSRAM: - CHIPLED LG R971, LG N971, LY N971, LG Q971, LY Q971, LO R971, LY R971 LH N974, LH R974 LS Q976, LO Q976, LY Q976 LO Q996 - Hyper CHIPLED LW Q18S LB Q993, LB Q99A, LB R99A - SideLED LS A670, LO A670, LY A670, LG A670, LP A670 LB A673, LV A673, LT A673, LW A673 LH A674 LY A675 LS A676, LA A676, LO A676, LY A676, LW A676 LS A679, LY A679, LG A679 - Hyper Micro SIDELED® LS Y876, LA Y876, LO Y876, LY Y876 LT Y87S - SmartLED LW L88C, LW L88S LB L89C, LB L89S, LG L890 LS L89K, LO L89K, LY L89K LS L896, LA L896, LO L896, LY L896 - TOPLED LS T670, LO T670, LY T670, LG T670, LP T670 LSG T670, LSP T670, LSY T670, LOP T670, LYG T670 LG T671, LOG T671, LSG T671 LB T673, LV T673, LT T673, LW T673 LH T674 LS T676, LA T676, LO T676, LY T676, LB T676, LH T676, LSB T676, LW T676 LB T67C, LV T67C, LT T67C, LS T67K, LO T67K, LY T67K, LW E67C LS E67B, LA E67B, LO E67B, LY E67B, LB E67C, LV E67C, LT E67C LW T67C LS T679, LY T679, LG T679 LS T770, LO T770, LY T770, LG T770, LP T770 LB T773, LV T773, LT T773, LW T773 LH T774 LS E675, LA E675, LY E675, LS T675 LS T776, LA T776, LO T776, LY T776, LB T776 LHGB T686 LT T68C, LB T68C - Hyper Mini TOPLED® LB M676 - Mini TOPLED Santana® LG M470 LS M47K, LO M47K, LY M47K Source: http://www.osram.convergy.de LUXEON: - LUMILED® LXK2-PW12-R00, LXK2-PW12-S00, LXK2-PW14-U00, LXK2-PW14-V00 LXK2-PM12-R00, LXK2-PM12-S00, LXK2-PM14-U00 LXK2-PE12-Q00, LXK2-PE12-R00, LXK2-PE12-S00, LXK2-PE14-T00, LXK2-PE14-U00 LXK2-PB12-K00, LXK2-PB12-L00, LXK2-PB12-M00, LXK2-PB14-N00, LXK2-PB14-P00, LXK2-PB14-Q00 LXK2-PR12-L00, LXK2-PR12-M00, LXK2-PR14-Q00, LXK2-PR14-R00 LXK2-PD12-Q00, LXK2-PD12-R00, LXK2-PD12-S00 LXK2-PH12-R00, LXK2-PH12-S00 LXK2-PL12-P00, LXK2-PL12-Q00, LXK2-PL12-R00 Source: www.luxeon.com KINGBRIGHT: KA-3528ASYC Source: www.kingbright.com; DIGIKEY#: 160-1659-ND; MANF: Lite-On Inc; MANF#: LTL1CHKGKNN
MCU = gator:STM32F417VGT6; DIGIKEY#: 497-11900-ND; MANF: STMicroelectronics; MANF#: STM32F417VGT6
MIC5219-3.3YM5_1 MIC5219-3.3YM5_2 = SparkFun-PowerIC:V_REG_LDO: Voltage Regulator LDO Standard 150mA LDO voltage regulator in SOT-23 layout. Micrel part MIC5205. BP (by-pass) pin is used to lower output noise with 470pF cap.; DIGIKEY#: 576-1281-1-ND; MANF: Micrel Inc; MANF#: MIC5219-3.3YM5 TR
MIC5219-5.0YM1 MIC5219-5.0YM5 = SparkFun-PowerIC:V_REG_LDO: Voltage Regulator LDO Standard 150mA LDO voltage regulator in SOT-23 layout. Micrel part MIC5205. BP (by-pass) pin is used to lower output noise with 470pF cap.; DIGIKEY#: 576-2770-1-ND; MANF: Micrel Inc; MANF#: MIC5219-5.0YM5 TR
MICROSD = SparkFun-Connectors:USD-SOCKET: microSD Socket Push-push type uSD socket. Schematic element and footprint production proven. Spark Fun Electronics SKU : PRT-00127. tDoc lines correctly indicate media card edge positions when inserting (unlocked, locked, depressed).; DIGIKEY#: 101-00660-68-6-1-ND; MANF: Amphenol Commercial Products; MANF#: 101-00660-68-6
NCP565ST12T3G = microbuilder:LM1117: LM1117 Voltage Regulator LM1117 Adjustable Voltage regulator [Digikey: LM1117IMP-ADJDKR-ND] LM1117 3.3V Voltage regulator [AP1117E33GDIDKR-ND] LM1117 5.0V Voltage regulator [AP1117E50GDIDKR-ND] SOT223-REFLOW - SOT223 package for solder paste/reflow ovens SOT223-WAVE - SOT223 package for hand-soldering (larger pads) Note: For the fixed-voltage regulators, simply set the ADJ pin to GND.; DIGIKEY#: NCP565ST12T3GOSCT-ND; MANF: ON Semiconductor; MANF#: NCP565ST12T3G
OSC_50M = SparkFun-FreqCtrl:OSCILLATOR: Generic 5x3 and 7x5 oscillators; DIGIKEY#: CTX1011CT-ND; MANF: CTS-Frequency Controls; MANF#: 636L3C050M00000
R1-R26 R29-R44 = SparkFun-Passives:RESISTOR: Resistor Basic schematic elements and footprints for 0603, 1206, and PTH resistors.
R27 R28 = SparkFun-Passives:RESISTOR-ARRAY: Array Chip Resistor Source: RS Component / Phycomp; DIGIKEY#: YC164J-51CT-ND; MANF: Yageo; MANF#: YC164-JR-0751RL
RESET = SparkFun-Electromechanical:TAC_SWITCH: Momentary Switch Button commonly used for reset or general input. Spark Fun Electronics SKU : COM-00097
RJ45 = SparkFun-Connectors:MAGJACK-2: RJ-45 with LEDs; DIGIKEY#: 380-1103-ND; MANF: Stewart Connector; MANF#: SI-50170-F
SDRAM = gator:MT48LC16M16A2P; DIGIKEY#: 557-1223-1-ND; MANF: Micron Technology Inc; MANF#: MT48LC16M16A2P-6A:D TR; MOUSER#: 913-AS4C16M16S-6TAN
U$2 = gator:HDMI_A; DIGIKEY#: WM19084CT-ND; MANF: Molex Inc; MANF#: 5002541927
U$3 = gator:PCA9527; DIGIKEY#: 568-4770-1-ND; MANF: NXP Semiconductors; MANF#: PCA9527DP,118
U$4 = gator:GATOR_HEAD; DIGIKEY#: T1065-P5P-ND; MANF: CUI Inc; MANF#: ETSA060200UDC-P5P-SZ
X1 = SparkFun-Connectors:USB: USB Connectors USB-B-PTH is fully proven SKU : PRT-00139 USB-miniB is fully proven SKU : PRT-00587 USB-A-PCB is untested. USB-A-H is throughly reviewed, but untested. Spark Fun Electronics SKU : PRT-00437 USB-B-SMT is throughly reviewed, but untested. Needs silkscreen touching up. USB-A-S has not been used/tested USB-MB-H has not been used/tested; DIGIKEY#: 1175-1016-ND; MANF: CNC Tech; MANF#: 1002-002-01100
Y1 = SparkFun-FreqCtrl:CRYSTAL: Various standard crystals. Proven footprints. Spark Fun Electronics SKU : COM-00534; DIGIKEY#: CTX904-ND; MANF: CTS-Frequency Controls; MANF#: ATS120B